# EasyEDA Pro project ProPrj_IRIS_2026-04-09.epro, schematic Schematic1
Board Name: Board1; Create Date: 2026-03-19; Page Name: P1; Project Name: Drone; Schematic Name: Schematic1; Update Date: 2026-04-08; Company: EasyEDA.com; Page Size: A4; Version: V1.0
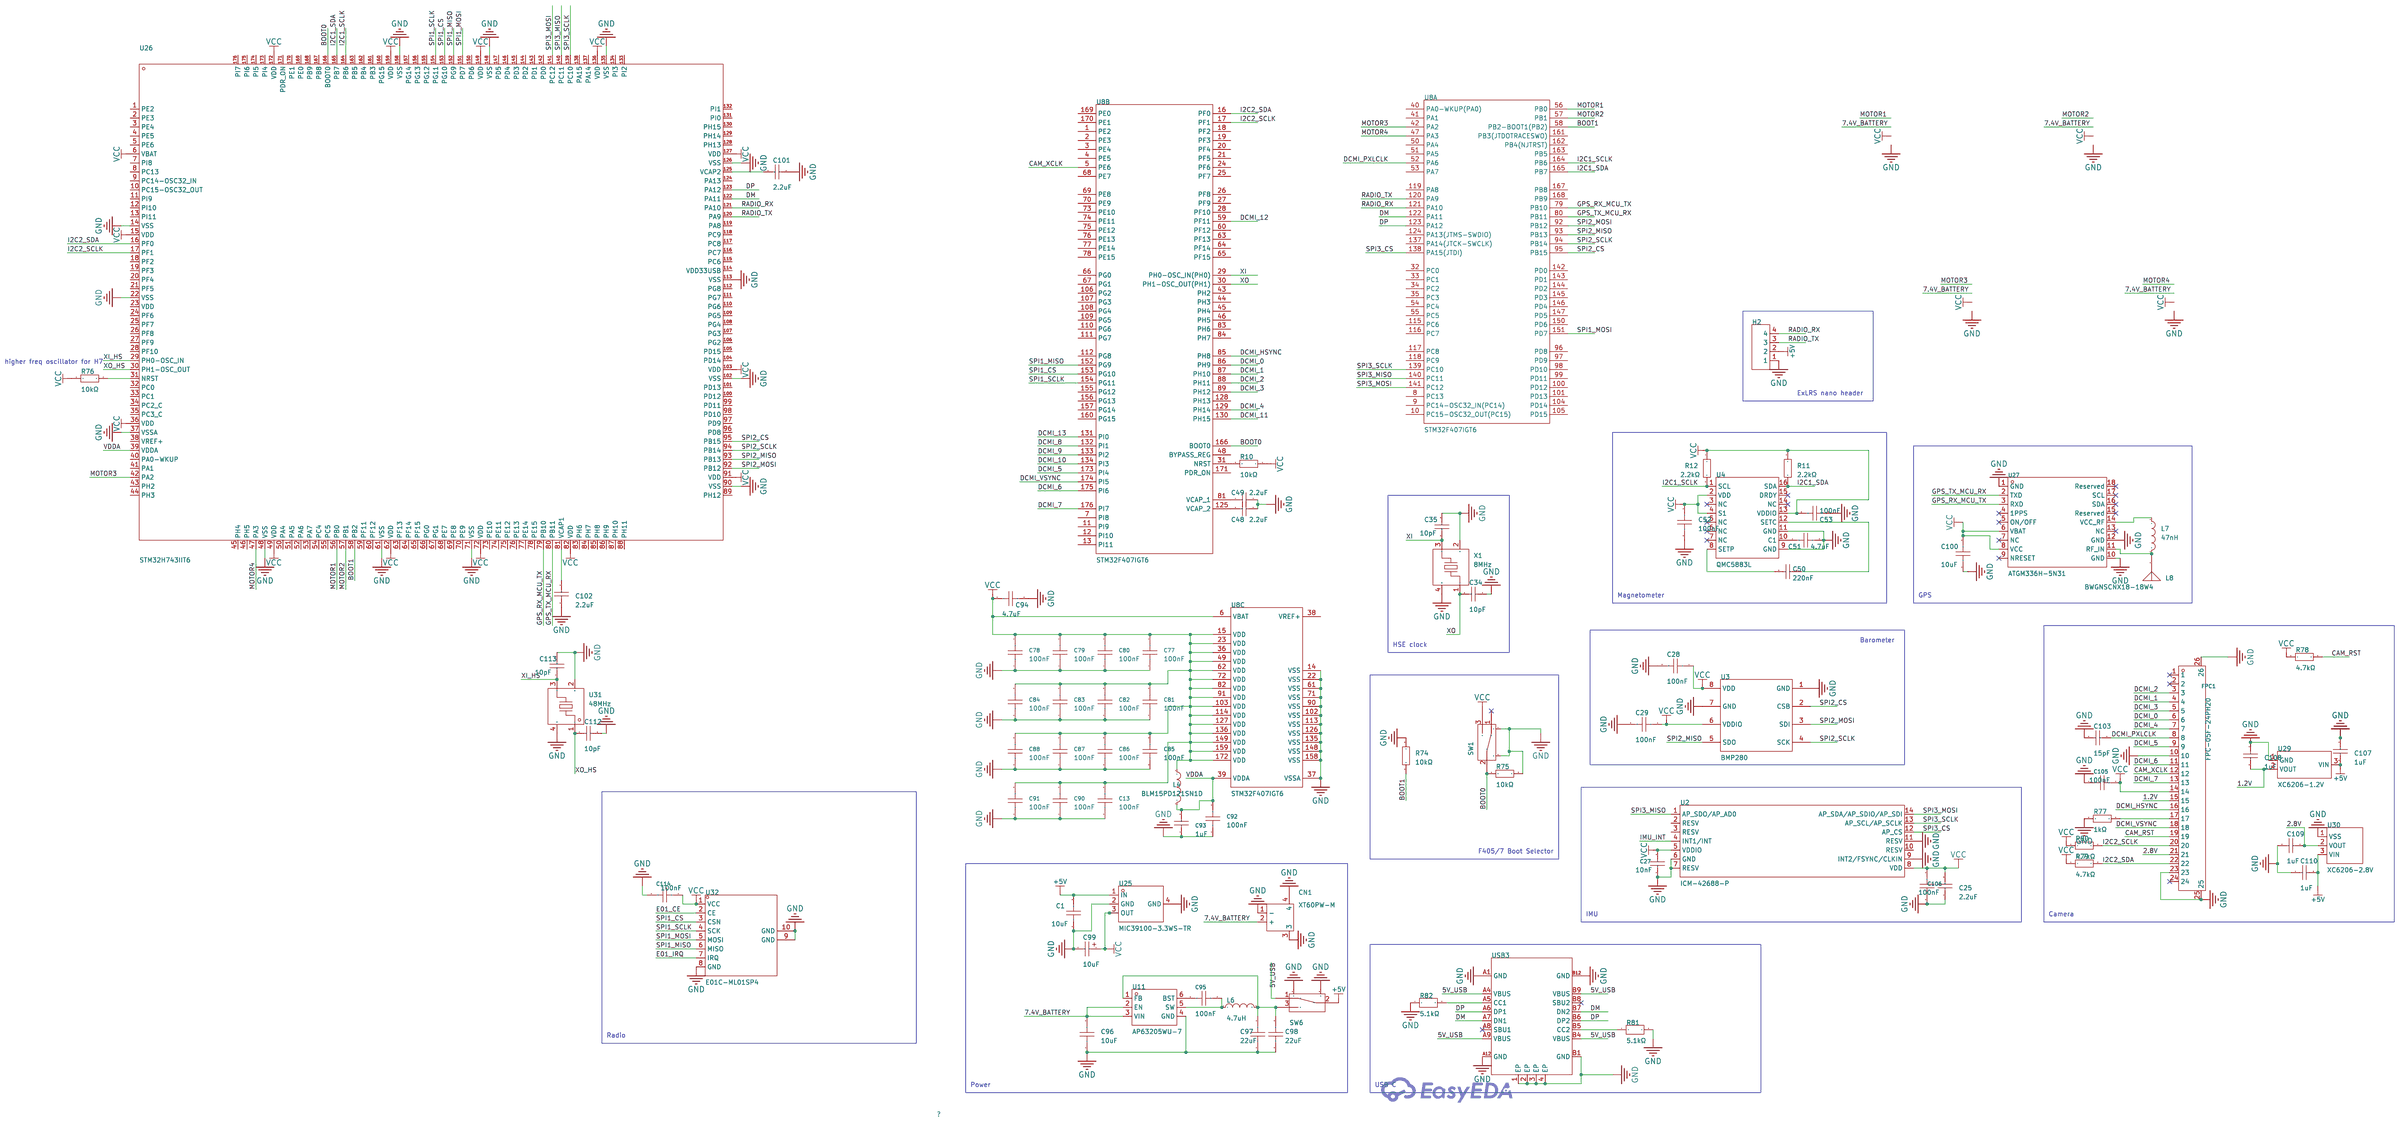
[diagram p1: schematic sheet]

## Parts
C1  10uF  [C0603]
C13  100nF  [C0402]
C25  2.2uF  [C0603]
C27  10nF  [C0603]
C28  100nF  [C0603]
C29  100nF  [C0603]
C34  10pF  [C0603]
C35  10pF  [C0603]
C48  2.2uF  [C0603]
C49  2.2uF  [C0603]
C50  220nF  [C0402]
C51  4.7uF  [C0603]
C52  100nF  [C0603]
C53  100nF  [C0603]
C77  100nF  [C0402]
C78  100nF  [C0402]
C79  100nF  [C0402]
C80  100nF  [C0402]
C81  100nF  [C0402]
C82  100nF  [C0402]
C83  100nF  [C0402]
C84  100nF  [C0402]
C85  100nF  [C0402]
C86  100nF  [C0402]
C87  100nF  [C0402]
C88  100nF  [C0402]
C90  100nF  [C0402]
C91  100nF  [C0402]
C92  100nF  [C0402]
C93  1uF  [C0402]
C94  4.7uF  [C0603]
C95  100nF  [C0402]
C96  10uF  [C0805]
C97  22uF  [C0603]
C98  22uF  [C0603]
C99  10uF  [CAP-SMD_L3.2-W1.6-RD-C7171]
C100  10uF  [C0603]
C101  2.2uF  [C0603]
C102  2.2uF  [C0603]
C103  15pF  [C0603]
C105  100nF  [C0402]
C106  100nF  [C0402]
C107  1uF  [C0402]
C108  1uF  [C0402]
C109  1uF  [C0402]
C110  1uF  [C0402]
C112  10pF  [C0603]
C113  10pF  [C0603]
C114  100nF  [C0402]
CBB1  -
CBB2  -
CBB3  -
CBB4  -
CN1  XT60PW-M  [CONN-TH_XT60PW-M]
FPC1  FPC-05F-24PH20  [FPC-SMD_24P-P0.50_FPC-05F-24PH20]
H2  HX PH254-01-04-Z-L11.5 straight pin header  [HDR-TH_4P-HX-PH254-01-04-Z-L11.5]
L4  BLM15PD121SN1D  [L0402]
L6  4.7uH  [IND-SMD_L3.0-W3.0-1]
L7  47nH  [IND-SMD_L1.8-W1.0]
L8  BWGNSCNX18-18W4  [ANT-TH_L18.0-W18.0_C9900026472]
R10  10kΩ  [R0603]
R11  2.2kΩ  [R0603]
R12  2.2kΩ  [R0603]
R74  10kΩ  [R0402]
R75  10kΩ  [R0402]
R76  10kΩ  [R0603]
R77  1kΩ  [R0402]
R78  4.7kΩ  [R0402]
R79  4.7kΩ  [R0402]
R80  4.7kΩ  [R0402]
R81  5.1kΩ  [R0603]
R82  5.1kΩ  [R0603]
SW1  -  [SW-TH_SK12D07VG3]
SW6  -  [SW-TH_SK12D07VG3]
U2  ICM-42688-P  [LGA-14_L3.0-W2.5-P0.50-TL]
U3  BMP280  [LGA-8_L2.5-W2.0-P0.65_AMP6127]
U4  QMC5883L  [LGA-16_L3.0-W3.0-P0.50-BL_SQ]
U8  STM32F407IGT6  [LQFP-176_L24.0-W24.0-P0.50-BL]  (sections 1,2,3)
U11  AP63205WU-7  [TSOT-23-6_L2.9-W1.6-P0.95-LS2.8-BL]
U25  MIC39100-3.3WS-TR  [SOT-223-4_L6.5-W3.5-P2.30-LS7.0-BR]
U26  STM32H743IIT6  [LQFP-176_L24.0-W24.0-P0.50-LS26.0-BL]
U27  ATGM336H-5N31  [GPSM-SMD_ATGM336H-TR]
U29  XC6206-1.2V  [SOT-23-3_L3.0-W1.6-P1.90-LS2.8-BR]
U30  XC6206-2.8V  [SOT-23-3_L2.9-W1.6-P1.90-LS2.8-BR]
U31  48MHz  [CRYSTAL-SMD_4P-L2.0-W1.6-BL]
U32  E01C-ML01SP4  [COMM-SMD_E01C-ML01SP4]
USB3  -  [USB-C-SMD_KH-TYPE-C-16P]
X1  8MHz  [CRYSTAL-SMD_4P-L3.2-W2.5-BL]

## Library data of the parts
C1 C100 = CL10A106KP8NNNC: Capacitance:10uF Tolerance:±10% Tolerance:±10% Voltage Rating:10V Temperature Coefficient:X5R; LCSC Part Name: 10uF ±10% 10V; Supplier Part: C19702; Manufacturer: SAMSUNG(三星); Supplier Footprint: 0603; Datasheet: https://item.szlcsc.com/datasheet/CL10A106KP8NNNC/20411.html; Supplier: LCSC; Tolerance: ±10%; Voltage Rating: 10V; Temperature Coefficient: X5R
C13 C77-C88 C90-C92 C95 C105 C106 C114 = CC0402KRX7R7BB104: Capacitance: Tolerance:±10% Tolerance:±10% Voltage Rated: Temperature Coefficient:; LCSC Part Name: 100nF ±10% 16V; Supplier Part: C60474; Manufacturer: YAGEO(国巨); Supplier Footprint: 0402; Datasheet: https://atta.szlcsc.com/upload/public/pdf/source/20211223/9278FD768280B81DDBEF48FA36411A03.pdf; Supplier: LCSC; Tolerance: ±10%
C25 C48 C49 C101 C102 = CL10A225KO8NNNC: Capacitance:2.2uF Tolerance:±10% Tolerance:±10% Voltage Rating:16V Temperature Coefficient:X5R; LCSC Part Name: 2.2uF ±10% 16V; Supplier Part: C23630; Manufacturer: SAMSUNG(三星); Supplier Footprint: 0603; JLCPCB Part Class: Basic Part; Datasheet: https://item.szlcsc.com/datasheet/CL10A225KO8NNNC/24366.html; Supplier: LCSC; Tolerance: ±10%; Voltage Rating: 16V; Temperature Coefficient: X5R
C27 = CC0603KRX7R9BB103: Capacitance:10nF Tolerance:±10% Tolerance:±10% Voltage Rating:50V Temperature Coefficient:X7R; LCSC Part Name: 10nF ±10% 50V; Supplier Part: C100042; Manufacturer: YAGEO(国巨); Supplier Footprint: 0603; Datasheet: https://item.szlcsc.com/datasheet/CC0603KRX7R9BB103/101256.html; Supplier: LCSC; Tolerance: ±10%; Voltage Rating: 50V; Temperature Coefficient: X7R
C28 C29 C52 C53 = CC0603KRX7R9BB104: Capacitance:100nF Tolerance:±10% Tolerance:±10% Voltage Rating:50V Temperature Coefficient:X7R; LCSC Part Name: 100nF ±10% 50V; Supplier Part: C14663; Manufacturer: YAGEO(国巨); Supplier Footprint: 0603; JLCPCB Part Class: Basic Part; Datasheet: https://item.szlcsc.com/datasheet/CC0603KRX7R9BB104/15331.html; Supplier: LCSC; Tolerance: ±10%; Voltage Rating: 50V; Temperature Coefficient: X7R
C34 C35 C112 C113 = CC0603JRNPO9BN100: Capacitance:10pF Tolerance:±5% Tolerance:±5% Voltage Rating:50V Temperature Coefficient:NP0; LCSC Part Name: 10pF ±5% 50V; Supplier Part: C106245; Manufacturer: YAGEO(国巨); Supplier Footprint: 0603; JLCPCB Part Class: Extended Part; Datasheet: https://item.szlcsc.com/datasheet/CC0603JRNPO9BN100/107460.html; Supplier: LCSC; Tolerance: ±5%; Voltage Rating: 50V; Temperature Coefficient: NP0
C50 = CL05B224KO5NNNC: Capacitance:220nF Tolerance:±10% Tolerance:±10% Voltage Rating:16V Temperature Coefficient:X7R; LCSC Part Name: 220nF ±10% 16V; Supplier Part: C16772; Manufacturer: SAMSUNG(三星); Supplier Footprint: 0402; Datasheet: https://item.szlcsc.com/datasheet/CL05B224KO5NNNC/17456.html; Supplier: LCSC; Tolerance: ±10%; Voltage Rating: 16V; Temperature Coefficient: X7R
C51 C94 = CL10A475KO8NNNC: Capacitance:4.7uF Tolerance:±10% Tolerance:±10% Voltage Rating:16V Temperature Coefficient:X5R; LCSC Part Name: 4.7uF ±10% 16V; Supplier Part: C19666; Manufacturer: SAMSUNG(三星); Supplier Footprint: 0603; Datasheet: https://item.szlcsc.com/datasheet/CL10A475KO8NNNC/20375.html; Supplier: LCSC; Tolerance: ±10%; Voltage Rating: 16V; Temperature Coefficient: X5R
C93 = CL05A105KO5NNNC: Capacitance:1uF Tolerance:±10% Tolerance:±10% Voltage Rating:16V Temperature Coefficient:X5R; LCSC Part Name: 1uF ±10% 16V; Supplier Part: C29266; Manufacturer: SAMSUNG(三星); Supplier Footprint: 0402; JLCPCB Part Class: Extended Part; Datasheet: https://item.szlcsc.com/datasheet/CL05A105KO5NNNC/30018.html; Supplier: LCSC; Tolerance: ±10%; Voltage Rating: 16V; Temperature Coefficient: X5R
C96 = CL21B106KOQNNNE: Capacitance:10uF Tolerance:±10% Tolerance:±10% Voltage Rating:16V Temperature Coefficient:X7R; LCSC Part Name: 10uF ±10% 16V; Supplier Part: C95841; Manufacturer: SAMSUNG(三星); Supplier Footprint: 0805; JLCPCB Part Class: Extended Part; Datasheet: https://item.szlcsc.com/datasheet/CL21B106KOQNNNE/97045.html; Supplier: LCSC; Tolerance: ±10%; Voltage Rating: 16V; Temperature Coefficient: X7R
C97 C98 = CL10A226MP8NUNE: Capacitance:22uF Tolerance:±20% Tolerance:±20% Voltage Rating:10V Temperature Coefficient:X5R; LCSC Part Name: 22uF ±20% 10V; Supplier Part: C86295; Manufacturer: SAMSUNG(三星); Supplier Footprint: 0603; Datasheet: https://item.szlcsc.com/datasheet/CL10A226MP8NUNE/87471.html; Supplier: LCSC; Tolerance: ±20%; Voltage Rating: 10V; Temperature Coefficient: X5R
C99 = TAJA106K016RNJ: Capacitance:10uF Tolerance:±10% Tolerance:±10% Voltage Rating:16V Equivalent Series Resistance(ESR):3Ω@100kHz Operating Temperature:-55℃~+125℃ Operating Temperature:-55℃~+125℃; LCSC Part Name: 10uF ±10% 16V; Supplier Part: C7171; Manufacturer: Kyocera AVX; Supplier Footprint: CASE-A-3216-18(mm); JLCPCB Part Class: Basic Part; Supplier: LCSC; Tolerance: ±10%; Voltage Rating: 16V; Equivalent Series Resistance(ESR): 3Ω@100kHz; Operating Temperature: -55℃~+125℃
C103 = CL10C150JB8NNNC: Capacitance:15pF Tolerance:±5% Tolerance:±5% Voltage Rating:50V Temperature Coefficient:C0G; LCSC Part Name: 15pF ±5% 50V; Supplier Part: C1644; Manufacturer: SAMSUNG(三星); Supplier Footprint: 0603; JLCPCB Part Class: Basic Part; Datasheet: https://item.szlcsc.com/datasheet/CL10C150JB8NNNC/1996.html; Supplier: LCSC; Tolerance: ±5%; Voltage Rating: 50V; Temperature Coefficient: C0G
C107-C110 = CL05A105KP5NNNC: Capacitance:1uF Tolerance:±10% Tolerance:±10% Voltage Rating:10V Temperature Coefficient:X5R; LCSC Part Name: 1uF ±10% 10V; Supplier Part: C14445; Manufacturer: SAMSUNG(三星); Supplier Footprint: 0402; Datasheet: https://item.szlcsc.com/datasheet/CL05A105KP5NNNC/15107.html; Supplier: LCSC; Tolerance: ±10%; Voltage Rating: 10V; Temperature Coefficient: X5R
CN1 = XT60PW-M: colour:Yellow Connector type:Horizontal plug interface form:Male; LCSC Part Name: AMASS(艾迈斯)航模插头xt60连接器150公母对接pw锂电池公头 接PCB板卧式 黄色 公头XT60PW-M.G.Y; Supplier Part: C98732; Manufacturer: AMASS(艾迈斯); Datasheet: https://item.szlcsc.com/datasheet/XT60PW-M/99942.html; Supplier: LCSC; colour: Yellow; Connector type: Horizontal plug; interface form: Male
FPC1 = FPC-05F-24PH20: Locking Feature:Hinged Lid Contact Type:Surface Mount Number of Contacts:24P Pitch:0.5mm Mounting Type:Bottom Contact FFC, FCB Thickness:0.3mm FFC, FCB Thickness:0.3mm Height Above Board:2mm Contact Material:Phosphor Bronze Contact Plating:Tin Operating T; LCSC Part Name: 翻盖式 卧贴 P数:24P 间距:0.5mm; Supplier Part: C2856805; Manufacturer: XUNPU(讯普); Supplier Footprint: SMD,P=0.5mm,卧贴; JLCPCB Part Class: Extended Part; Datasheet: https://item.szlcsc.com/datasheet/FPC-05F-24PH20/3056903.html; Supplier: LCSC; Locking Feature: Hinged Lid; Contact Type: Surface Mount; Number of Contacts: 24P; Pitch: 0.5mm; Mounting Type: Bottom Contact; FFC, FCB Thickness: 0.3mm; Height Above Board: 2mm; Contact Material: Phosphor Bronze; Contact Plating: Tin; Operating Temperature: -25℃~+85℃; Rated Voltage (Max): 50V; Current Rating (Max): 500mA
H2 = HX PH254-01-04-Z-L11.5 straight pin header: Pin Structure:1x4P Pitch:2.54mm Circluar Pins/Square Pins:Pin Header Mounting Type:Through Hole Number of Rows:1 Number of Pins:4P Current Rating:3A Voltage Rating (Max):1kV Length of Mating Pin:6mm Insulation Height:2.5mm Length of End Connection Pin:3mm; LCSC Part Name: 1x4P 间距:2.54mm 方针 直插; Supplier Part: C52016392; Manufacturer: hanxia(韩下); Supplier Footprint: 插件,P=2.54mm; JLCPCB Part Class: Extended Part; Datasheet: https://item.szlcsc.com/datasheet/HX%2520PH254-01-04-Z-L11.5%2520straight%2520pin%2520header/54760437.html; Supplier: LCSC; Pin Structure: 1x4P; Pitch: 2.54mm; Circluar Pins/Square Pins: Pin Header; Mounting Type: Through Hole; Number of Rows: 1; Number of Pins: 4P; Current Rating: 3A; Voltage Rating (Max): 1kV; Length of Mating Pin: 6mm; Insulation Height: 2.5mm; Length of End Connection Pin: 3mm; Contact Material: Brass; Contact Plating: Gold; Operating Temperature: -40℃~+105℃
L4 = BLM15PD121SN1D: Impedance @ Frequency:120Ω@100MHz Tolerance:±25% Tolerance:±25% DC Resistance(DCR):90mΩ Current Rating:1.3A Number of Circuits:1 Operating Temperature:-55℃~+125℃ Operating Temperature:-55℃~+125℃; LCSC Part Name: 单路 0402磁珠 阻抗120Ω@100MHz; Supplier Part: C76891; Manufacturer: muRata(村田); Supplier Footprint: 0402; JLCPCB Part Class: Extended Part; Datasheet: https://item.szlcsc.com/datasheet/BLM15PD121SN1D/78018.html; Supplier: LCSC; Impedance @ Frequency: 120Ω@100MHz; Tolerance: ±25%; DC Resistance(DCR): 90mΩ; Current Rating: 1.3A; Number of Circuits: 1; Operating Temperature: -55℃~+125℃
L6 = ANR3015T4R7M: Inductance:4.7uH Tolerance:±20% Tolerance:±20% Current Rating:1.3A Current - Saturation(Isat):1.4A Type:Magnetic Shielded Inductor; LCSC Part Name: 4.7uH ±20% 1.4A 3x3x1.5mm; Supplier Part: C7427089; Manufacturer: APV(爱普微); Supplier Footprint: SMD,3x3mm; Datasheet: https://item.szlcsc.com/datasheet/ANR3015T4R7M/8418961.html; Supplier: LCSC; Tolerance: ±20%; Current Rating: 1.3A; Current - Saturation(Isat): 1.4A; Type: Magnetic Shielded Inductor
L7 = AHW1608C-47NJTF: Inductance:47nH Tolerance:±5% Tolerance:±5% Current Rating:600mA DC Resistance(DCR):0.28Ω Q @ Frequency:38 Frequency - Self Resonant:2000MHz Type:Wire-wound Chip Inductor; LCSC Part Name: 47nH ±5%; Supplier Part: C6807998; Manufacturer: APV(爱普微); Supplier Footprint: 0603; JLCPCB Part Class: Extended Part; Datasheet: https://atta.szlcsc.com/upload/public/pdf/source/20230523/1C3BB767D502EE2DA5073F35EE6596F6.pdf; Supplier: LCSC; Tolerance: ±5%; Current Rating: 600mA; DC Resistance(DCR): 0.28Ω; Q @ Frequency: 38; Frequency - Self Resonant: 2000MHz; Type: Wire-wound Chip Inductor
L8 = BWGNSCNX18-18W4: Antenna Type:Ceramic Antenna Frequency(Center/Band):1.57542GHz Bandwidth:10MHz Peak Gain:3dBi Peak Gain:3dBi Impedance:50Ω Power:50W VSWR:1.8 Operating Temperature:-40℃~+80℃ Operating Temperature:-40℃~+80℃ Length:18mm Width:18mm Height:4mm; LCSC Part Name: GNSS无源陶瓷片天线厚款; Supplier Part: C784395; Manufacturer: BAT WIRELESS(蝙蝠无线); Supplier Footprint: 插件,18x18mm; Datasheet: https://item.szlcsc.com/datasheet/BWGNSCNX18-18W4/839637.html; Supplier: LCSC; Antenna Type: Ceramic Antenna; Frequency(Center/Band): 1.57542GHz; Bandwidth: 10MHz; Peak Gain: 3dBi; Impedance: 50Ω; Power: 50W; VSWR: 1.8; Operating Temperature: -40℃~+80℃; Length: 18mm; Width: 18mm; Height: 4mm
R10 R76 = RC0603FR-0710KL: Type:Thick Film Resistors Resistance: Tolerance:±1% Tolerance:±1% Power(Watts): Overload Voltage (Max): Temperature Coefficient:±100ppm/℃ Temperature Coefficient:±100ppm/℃ Operating Temperature Range:-55℃~+155℃ Operating Temperature Range:-55℃~+155℃; LCSC Part Name: 厚膜电阻 10kΩ ±1% 100mW; Supplier Part: C98220; Manufacturer: YAGEO(国巨); Supplier Footprint: 0603; JLCPCB Part Class: Extended Part; Datasheet: https://atta.szlcsc.com/upload/public/pdf/source/20180927/C295883_E8D83085EA81BD7DE0B2B681138C15EE.pdf; Supplier: LCSC; Type: Thick Film Resistors; Tolerance: ±1%; Temperature Coefficient: ±100ppm/℃; Operating Temperature Range: -55℃~+155℃
R11 R12 = RC0603FR-072K2L: Type:Thick Film Resistor Resistance:2.2kΩ Tolerance:±1% Tolerance:±1% Power(Watts):100mW Voltage-Supply(Max):75V Temperature Coefficient:±100ppm/℃ Temperature Coefficient:±100ppm/℃ Operating Temperature:-55℃~+155℃ Operating Temperature:-55℃~+155℃; LCSC Part Name: 厚膜电阻 2.2kΩ ±1% 100mW; Supplier Part: C114662; Manufacturer: YAGEO(国巨); Supplier Footprint: 0603; Datasheet: https://item.szlcsc.com/datasheet/RC0603FR-072K2L/115906.html; Supplier: LCSC; Type: Thick Film Resistor; Tolerance: ±1%; Power(Watts): 100mW; Voltage-Supply(Max): 75V; Temperature Coefficient: ±100ppm/℃; Operating Temperature: -55℃~+155℃
R74 R75 = RC0402FR-0710KL: Type:Thick Film Resistor Resistance:10kΩ Tolerance:±1% Tolerance:±1% Power(Watts):62.5mW Voltage-Supply(Max):50V Temperature Coefficient:±100ppm/℃ Temperature Coefficient:±100ppm/℃ Operating Temperature:-55℃~+155℃ Operating Temperature:-55℃~+155℃; LCSC Part Name: 厚膜电阻 10kΩ ±1% 62.5mW; Supplier Part: C60490; Manufacturer: YAGEO(国巨); Supplier Footprint: 0402; JLCPCB Part Class: Extended Part; Datasheet: https://item.szlcsc.com/datasheet/RC0402FR-0710KL/61542.html; Supplier: LCSC; Type: Thick Film Resistor; Tolerance: ±1%; Power(Watts): 62.5mW; Voltage-Supply(Max): 50V; Temperature Coefficient: ±100ppm/℃; Operating Temperature: -55℃~+155℃
R77 = RC0402FR-071KL: Type:Thick Film Resistor Resistance:1kΩ Tolerance:±1% Tolerance:±1% Power(Watts):62.5mW Voltage-Supply(Max):50V Temperature Coefficient:±100ppm/℃ Temperature Coefficient:±100ppm/℃ Operating Temperature:-55℃~+155℃ Operating Temperature:-55℃~+155℃; LCSC Part Name: 厚膜电阻 1kΩ ±1% 62.5mW; Supplier Part: C106235; Manufacturer: YAGEO(国巨); Supplier Footprint: 0402; JLCPCB Part Class: Extended Part; Datasheet: https://item.szlcsc.com/datasheet/RC0402FR-071KL/107450.html; Supplier: LCSC; Type: Thick Film Resistor; Tolerance: ±1%; Power(Watts): 62.5mW; Voltage-Supply(Max): 50V; Temperature Coefficient: ±100ppm/℃; Operating Temperature: -55℃~+155℃
R78-R80 = RC0402FR-074K7L: Type:Thick Film Resistor Resistance:4.7kΩ Tolerance:±1% Tolerance:±1% Power(Watts):62.5mW Voltage-Supply(Max):50V Temperature Coefficient:±100ppm/℃ Temperature Coefficient:±100ppm/℃ Operating Temperature:-55℃~+155℃ Operating Temperature:-55℃~+155℃; LCSC Part Name: 厚膜电阻 4.7kΩ ±1% 62.5mW; Supplier Part: C105871; Manufacturer: YAGEO(国巨); Supplier Footprint: 0402; JLCPCB Part Class: Extended Part; Datasheet: https://item.szlcsc.com/datasheet/RC0402FR-074K7L/107086.html; Supplier: LCSC; Type: Thick Film Resistor; Tolerance: ±1%; Power(Watts): 62.5mW; Voltage-Supply(Max): 50V; Temperature Coefficient: ±100ppm/℃; Operating Temperature: -55℃~+155℃
R81 R82 = FRC0603F5101TS: Type:Thick Film Resistor Resistance:5.1kΩ Tolerance:±1% Tolerance:±1% Power(Watts):100mW Voltage-Supply(Max):75V Temperature Coefficient:±100ppm/℃ Temperature Coefficient:±100ppm/℃ Operating Temperature:-55℃~+155℃ Operating Temperature:-55℃~+155℃; LCSC Part Name: 5.1kΩ ±1% 100mW 厚膜电阻; Supplier Part: C2907044; Manufacturer: FOJAN(富捷); Supplier Footprint: 0603; JLCPCB Part Class: Extended Part; Supplier: LCSC; Type: Thick Film Resistor; Tolerance: ±1%; Power(Watts): 100mW; Voltage-Supply(Max): 75V; Temperature Coefficient: ±100ppm/℃; Operating Temperature: -55℃~+155℃
SW1 SW6 = SK12D07VG3: Supplier Footprint: Through
U2 = ICM-42688-P: Sensor Type:Accelerometer gyroscope; Supplier Part: C1850418; Manufacturer: TDK InvenSense(应美盛); Supplier Footprint: LGA-14(2.5x3); JLCPCB Part Class: Extended Part; Datasheet: https://atta.szlcsc.com/upload/public/pdf/source/20210703/CF24204867ACE5B754A2B035F23E5931.pdf; Supplier: LCSC; Sensor Type: Accelerometer gyroscope
U3 = BMP280: Pressure range:30Kpa~1.1bar Pressure range:30Kpa~1.1bar Voltage - Supply:1.71V~3.6V Voltage - Supply:1.71V~3.6V Standby Current:300nA Interface:SPI；I2C Operating Temperature:-40℃~+85℃ Operating Temperature:-40℃~+85℃ Absolute Accuracy:1hpa Relative Accurac; Supplier Part: C83291; Manufacturer: Bosch(博世); Supplier Footprint: LGA-8(2x2.5); Datasheet: https://item.szlcsc.com/datasheet/BMP280/84455.html; Supplier: LCSC; Pressure range: 30Kpa~1.1bar; Voltage - Supply: 1.71V~3.6V; Standby Current: 300nA; Interface: SPI；I2C; Operating Temperature: -40℃~+85℃; Absolute Accuracy: 1hpa; Relative Accuracy: 0.12hpa; Temperature Coefficient of Offset(TCO): 1.5pa/K
U4 = QMC5883L: Magnetic Sensing Range(X,Y):±8Gs Magnetic Sensing Range(X,Y):±8Gs Magnetic Sensing Range(Z):±8Gs Magnetic Sensing Range(Z):±8Gs Output bit:16bit Interface Type:I2C Voltage - Supply:2.16V~3.6V Voltage - Supply:2.16V~3.6V Current - Supply:75uA Operating Tem; LCSC Part Name: 三轴磁传感器 停产; Supplier Part: C976032; Manufacturer: QST(上海矽睿); Supplier Footprint: LGA-16(3x3); Datasheet: https://item.szlcsc.com/datasheet/QMC5883L/1066453.html; Supplier: LCSC; Magnetic Sensing Range(X,Y): ±8Gs; Magnetic Sensing Range(Z): ±8Gs; Output bit: 16bit; Interface Type: I2C; Voltage - Supply: 2.16V~3.6V; Current - Supply: 75uA; Operating Temperature: -40℃~+85℃
U8 = STM32F407IGT6: CPU Core:ARM Cortex-M4 CPU Maximum Speed:168MHz Core Size:32 Bit Program Storage Size:1MB Program Memory Type:FLASH RAM Size:192KB EEPROM:- Number of I/O:140 ADC (Bit):12bit DAC (Bit):12bit Oscillator Type:Built-in Voltage - Supply:1.8V~3.6V Voltage - Sup; LCSC Part Name: 带DSP和FPU的高性能基础系列ARM Cortex-M4 MCU，具有1 MB Flash、168 MHz CPU、ART加速器、以太网和FSMC; Supplier Part: C33993; Manufacturer: ST(意法半导体); Supplier Footprint: LQFP-176(24x24); JLCPCB Part Class: Extended Part; Datasheet: https://item.szlcsc.com/datasheet/STM32F407IGT6/34961.html; Supplier: LCSC; CPU Core: ARM Cortex-M4; CPU Maximum Speed: 168MHz; Core Size: 32 Bit; Program Storage Size: 1MB; Program Memory Type: FLASH; RAM Size: 192KB; Number of I/O: 140; ADC (Bit): 12bit; DAC (Bit): 12bit; Oscillator Type: Built-in; Voltage - Supply: 1.8V~3.6V; Operating Temperature: -40℃~+85℃
U11 = AP63205WU-7: Function:Buck Voltage - Supply:3.8V~32V Voltage - Supply:3.8V~32V Output Voltage:5V Output Voltage:5V Output Current:2A Frequency - Switching:1.1MHz Frequency - Switching:1.1MHz Operating Temperature:-40℃~+85℃@(TA) Operating Temperature:-40℃~+85℃@(TA) Syn; LCSC Part Name: 3.8V至32V输入、2A低静态电流同步降压转换器，增强EMI抑制; Supplier Part: C2071056; Manufacturer: DIODES(美台); Supplier Footprint: TSOT-23-6; Datasheet: https://item.szlcsc.com/datasheet/AP63205WU-7/2162639.html; Supplier: LCSC; Function: Buck; Voltage - Supply: 3.8V~32V; Output Voltage: 5V; Output Current: 2A; Frequency - Switching: 1.1MHz; Operating Temperature: -40℃~+85℃@(TA); Synchronous Rectifier: Yes; Number of Outputs: 1; Topology: Buck; Quiescent Current: 22uA; Switch tube (built-in/external): Built-In; Output Type: Fixed
U25 = MIC39100-3.3WS-TR: Output Type:Fixed Voltage - Supply:16V Output Voltage:3.3V Output Voltage:3.3V Output Current:1A Power Supply Rejection Ratio (PSRR):- Voltage Dropout:630mV@(1A) standby current:20mA Features:Over Current Protection；Reverse Polarity Protection；Over Temper; LCSC Part Name: 输入16V 输出3.3V 1A; Supplier Part: C481371; Manufacturer: MICROCHIP(美国微芯); Supplier Footprint: SOT-223; JLCPCB Part Class: Extended Part; Datasheet: https://item.szlcsc.com/datasheet/MIC39100-3.3WS-TR/488912.html; Supplier: LCSC; Output Type: Fixed; Voltage - Supply: 16V; Output Voltage: 3.3V; Output Current: 1A; Voltage Dropout: 630mV@(1A); standby current: 20mA; Features: Over Current Protection；Reverse Polarity Protection；Over Temperature Protection; Operating Temperature: -40℃~+125℃@(Tj); Output Configuration: Positive; Number of Outputs: 1
U26 = STM32H743IIT6: CPU Core:- CPU Maximum Speed:480MHz Program Storage Size:2MB Program Memory Type:FLASH Number of I/O:140 ADC (Bit):16bit DAC (Bit):12bit Voltage - Supply:1.62V~3.6V Voltage - Supply:1.62V~3.6V; LCSC Part Name: 带DSP和DP-FPU的高性能ARM Cortex-M7 MCU，具有2 MB Flash、1 MB RAM、480 MHz CPU、ART加速器、一级缓存、外部存储器接口和大量外设; Supplier Part: C89597; Manufacturer: ST(意法半导体); Supplier Footprint: LQFP-176(24x24); Datasheet: https://item.szlcsc.com/datasheet/STM32H743IIT6/90777.html; Supplier: LCSC; CPU Maximum Speed: 480MHz; Program Storage Size: 2MB; Program Memory Type: FLASH; Number of I/O: 140; ADC (Bit): 16bit; DAC (Bit): 12bit; Voltage - Supply: 1.62V~3.6V
U27 = ATGM336H-5N31: GNSS Type:BDS；GPS Interface:UART；I2C Voltage - Supply:2.7V~3.6V Voltage - Supply:2.7V~3.6V Current - Supply:25mA@3.3V Sensitivity:-148dBm Sensitivity:-148dBm Accuracy:2.5m Time To First Fix:35s Operating Temperature:-40℃~+85℃ Operating Temperature:-40℃~+8; LCSC Part Name: BDS/GNSS 全星座定位导航模块; Supplier Part: C90770; Manufacturer: 杭州中科微; Supplier Footprint: SMD,10.1x9.7mm; Datasheet: https://item.szlcsc.com/datasheet/ATGM336H-5N31/91958.html; Supplier: LCSC; GNSS Type: BDS；GPS; Interface: UART；I2C; Voltage - Supply: 2.7V~3.6V; Current - Supply: 25mA@3.3V; Sensitivity: -148dBm; Accuracy: 2.5m; Time To First Fix: 35s; Operating Temperature: -40℃~+85℃
U29 = XC6206-1.2V_C49446790: Output Type:Fixed Voltage - Supply:6.5V Output Voltage:1.2V Output Voltage:1.2V Output Current:400mA Features:Short Circuit Protection；Over Current Protection Operating Temperature:-40℃~+125℃ Operating Temperature:-40℃~+125℃ Output Configuration:Positive; LCSC Part Name: 1.2V 400mA 6.5V; Supplier Part: C49446790; Manufacturer: YONGYUTAI(永裕泰); Supplier Footprint: SOT-23-3; Datasheet: https://item.szlcsc.com/datasheet/XC6206-1.2V/51987195.html; Supplier: LCSC; Output Type: Fixed; Voltage - Supply: 6.5V; Output Voltage: 1.2V; Output Current: 400mA; Features: Short Circuit Protection；Over Current Protection; Operating Temperature: -40℃~+125℃; Output Configuration: Positive; Number of Outputs: 1
U30 = XC6206-2.8V: Output Type:Fixed Voltage - Supply:6V Output Voltage:2.8V Output Voltage:2.8V Output Current:250mA Power Supply Rejection Ratio (PSRR):- Voltage Dropout:350mV@(30mA) standby current:1uA Noise:- Features:Over Current Protection Operating Temperature:-40℃~+; LCSC Part Name: 输入6V 输出2.8V 250mA; Supplier Part: C2892669; Manufacturer: YONGYUTAI(永裕泰); Supplier Footprint: SOT-23-3L; JLCPCB Part Class: Extended Part; Datasheet: https://item.szlcsc.com/datasheet/XC6206-2.8V/3124288.html; Supplier: LCSC; Output Type: Fixed; Voltage - Supply: 6V; Output Voltage: 2.8V; Output Current: 250mA; Voltage Dropout: 350mV@(30mA); standby current: 1uA; Features: Over Current Protection; Operating Temperature: -40℃~+85℃@(Ta); Output Configuration: Positive; Number of Outputs: 1
U31 = ABM11W-48.0000MHZ-7-B1U-T3: Frequency:48MHz Normal temperature Frequency Tolerance:±10ppm Normal temperature Frequency Tolerance:±10ppm Load Capacitor: Frequency Stability(Full temperature range):±10ppm Frequency Stability(Full temperature range):±10ppm Equivalent Series Resistance; LCSC Part Name: 48MHz ±10ppm 7pF; Supplier Part: C1985532; Manufacturer: ABRACON; Supplier Footprint: SMD2016-4P; Datasheet: https://atta.szlcsc.com/upload/public/pdf/source/20210612/25E10314463341ECFDA871AE575B9E16.pdf; Supplier: LCSC; Normal temperature Frequency Tolerance: ±10ppm; Frequency Stability(Full temperature range): ±10ppm; Equivalent Series Resistance (ESR): 40Ω
U32 = E01C-ML01SP4: LCSC Part Name: 2.4GHz无线数传收发模块国产Si24R1+PA+LNA透传兼容nRF24L01芯片; Supplier Part: C2965508; Manufacturer: EBYTE(亿佰特); Supplier Footprint: SMD,14.5x18mm; JLCPCB Part Class: Extended Part; Datasheet: https://item.szlcsc.com/datasheet/E01C-ML01SP4/3357269.html; Supplier: LCSC
USB3 = USB_TYPE-C-16P: Supplier Footprint: Through
X1 = Y32258MEBCX: Type:Crystal Oscillator Frequency:8MHz Normal temperature Frequency Tolerance:±10ppm Normal temperature Frequency Tolerance:±10ppm Load Capacitance:10pF Frequency Stability:±20ppm Frequency Stability:±20ppm Operating Temperature:-40℃~+85℃ Operating Temper; LCSC Part Name: 8MHz ±10ppm 10pF; Supplier Part: C49158085; Manufacturer: JLYE(晶力源); Supplier Footprint: SMD3225-4P; JLCPCB Part Class: Extended Part; Datasheet: https://item.szlcsc.com/datasheet/Y32258MEBCX/51546118.html; Supplier: LCSC; Type: Crystal Oscillator; Normal temperature Frequency Tolerance: ±10ppm; Load Capacitance: 10pF; Frequency Stability: ±20ppm; Operating Temperature: -40℃~+85℃

## Nets
1.2V: C108.2 FPC1.15 U29.2(VOUT)
2.8V: C109.2 FPC1.21 U30.2(VOUT)
5V_USB: SW6.1 USB3.A4(VBUS) USB3.A9(VBUS) USB3.B4(VBUS) USB3.B9(VBUS)
7.4V_BATTERY: C96.2 CBB1.2(VIN) CBB2.2(VIN) CBB3.2(VIN) CBB4.2(VIN) CN1.2(+) U11.2(EN) U11.3(VIN)
+5V: C1.2 C107.2 C110.2 H2.2 SW6.2 U25.1(IN) U29.3(VIN) U30.3(VIN)
GND: C1.1 C13.1 C25.1 C27.1 C28.2 C29.2 C34.2 C35.2 C48.2 C49.2 C51.2 C52.2 C53.2 C77.1 C78.1 C79.1 C80.1 C81.1 C82.1 C83.1 C84.1 C85.1 C86.1 C87.1 C88.1 C90.1 C91.1 C92.1 C93.1 C94.2 C96.1 C97.1 C98.1 C99.2 C100.1 C101.1 C102.1 C103.1 C105.1 C106.2 C107.1 C108.1 C109.1 C110.1 C112.2 C113.2 C114.2 CBB1.4(GND) CBB2.4(GND) CBB3.4(GND) CBB4.4(GND) CN1.1(-) CN1.3 CN1.4 FPC1.10 FPC1.23 FPC1.25 FPC1.26 H2.1 R74.2 R75.2 R77.1 R81.2 R82.1 SW1.4 SW1.5 SW6.4 SW6.5 U2.6(GND) U2.7(RESV) U2.9(INT2/FSYNC/CLKIN) U2.11(RESV) U3.1(GND) U3.7(GND) U4.9(GND) U4.11(GND) U8.14(VSS) U8.22(VSS) U8.37(VSSA) U8.61(VSS) U8.71(VSS) U8.90(VSS) U8.102(VSS) U8.113(VSS) U8.126(VSS) U8.135(VSS) U8.148(VSS) U8.158(VSS) U11.4(GND) U25.2(GND) U25.4(GND) U26.14(VSS) U26.22(VSS) U26.37(VSSA) U26.48(VSS) U26.61(VSS) U26.71(VSS) U26.90(VSS) U26.102(VSS) U26.113(VSS) U26.126(VSS) U26.135(VSS) U26.148(VSS) U26.158(VSS) U27.1(GND) U27.10(GND) U27.12(GND) U29.1(GND) U30.1(VSS) U31.2(GND) U31.4(GND) U32.8(GND) U32.9(GND) U32.10(GND) USB3.1(EP) USB3.2(EP) USB3.3(EP) USB3.4(EP) USB3.A1(GND) USB3.A12(GND) USB3.B1(GND) USB3.B12(GND) X1.2(GND) X1.4(GND)
VCC: C13.2 C25.2 C27.2 C28.1 C29.1 C52.1 C53.1 C77.2 C78.2 C79.2 C80.2 C81.2 C82.2 C83.2 C84.2 C85.2 C86.2 C87.2 C88.2 C90.2 C91.2 C94.1 C99.1 C100.2 C105.2 C106.1 C114.1 CBB1.3(3V3) CBB2.3(3V3) CBB3.3(3V3) CBB4.3(3V3) FPC1.14 L4.1 R10.1 R11.1 R12.1 R76.1 R78.1 R79.1 R80.1 SW1.3 U2.5(VDDIO) U2.8(VDD) U3.6(VDDIO) U3.8(VDD) U4.2(VDD) U4.4(S1) U4.13(VDDIO) U8.6(VBAT) U8.15(VDD) U8.23(VDD) U8.36(VDD) U8.49(VDD) U8.62(VDD) U8.72(VDD) U8.82(VDD) U8.91(VDD) U8.103(VDD) U8.114(VDD) U8.127(VDD) U8.136(VDD) U8.149(VDD) U8.159(VDD) U8.172(VDD) U25.3(OUT) U26.6(VBAT) U26.15(VDD) U26.36(VDD) U26.49(VDD) U26.62(VDD) U26.72(VDD) U26.82(VDD) U26.91(VDD) U26.103(VDD) U26.127(VDD) U26.136(VDD) U26.149(VDD) U26.159(VDD) U26.172(VDD) U27.6(VBAT) U27.8(VCC) U32.1(VCC)
VDDA: C92.2 C93.2 L4.2 U8.39(VDDA) U26.39(VDDA)
BOOT0: R75.1 SW1.2 U8.166(BOOT0) U26.166(BOOT0)
BOOT1: R74.1 U8.58(PB2-BOOT1(PB2)) U26.58(PB2)
CAM_RST: FPC1.19 R78.2
CAM_XCLK: FPC1.12 U8.5(PE6)
DCMI_0: FPC1.6 U8.86(PH9)
DCMI_1: FPC1.4 U8.87(PH10)
DCMI_2: FPC1.3 U8.88(PH11)
DCMI_3: FPC1.5 U8.89(PH12)
DCMI_4: FPC1.7 U8.129(PH14)
DCMI_5: FPC1.9 U8.173(PI4)
DCMI_6: FPC1.11 U8.175(PI6)
DCMI_7: FPC1.13 U8.176(PI7)
DCMI_8: U8.132(PI1)
DCMI_9: U8.133(PI2)
DCMI_10: U8.134(PI3)
DCMI_11: U8.130(PH15)
DCMI_12: U8.59(PF11)
DCMI_13: U8.131(PI0)
DCMI_HSYNC: FPC1.16 U8.85(PH8)
DCMI_PXLCLK: C103.2 FPC1.8 U8.52(PA6)
DCMI_VSYNC: FPC1.18 U8.174(PI5)
DM: U8.122(PA11) U26.122(PA11) USB3.A7(DN1) USB3.B7(DN2)
DP: U8.123(PA12) U26.123(PA12) USB3.A6(DP1) USB3.B6(DP2)
E01_CE: U32.2(CE)
E01_IRQ: U32.7(IRQ)
GPS_RX_MCU_TX: U8.79(PB10) U26.79(PB10) U27.3(RXD)
GPS_TX_MCU_RX: U8.80(PB11) U26.80(PB11) U27.2(TXD)
I2C1_SCLK: R12.2 U4.1(SCL) U8.164(PB6) U26.164(PB6)
I2C1_SDA: R11.2 U4.16(SDA) U8.165(PB7) U26.165(PB7)
I2C2_SCLK: FPC1.20 R80.2 U8.17(PF1) U26.17(PF1)
I2C2_SDA: FPC1.22 R79.2 U8.16(PF0) U26.16(PF0)
IMU_INT: U2.4(INT1/INT)
MOTOR1: CBB1.1(MOTOR_IN) U8.56(PB0) U26.56(PB0)
MOTOR2: CBB2.1(MOTOR_IN) U8.57(PB1) U26.57(PB1)
MOTOR3: CBB4.1(MOTOR_IN) U8.42(PA2) U26.42(PA2)
MOTOR4: CBB3.1(MOTOR_IN) U8.47(PA3) U26.47(PA3)
RADIO_RX: H2.4 U8.121(PA10) U26.121(PA10)
RADIO_TX: H2.3 U8.120(PA9) U26.120(PA9)
SPI1_CS: U8.153(PG10) U26.153(PG10) U32.3(CSN)
SPI1_MISO: U8.152(PG9) U26.152(PG9) U32.6(MISO)
SPI1_MOSI: U8.151(PD7) U26.151(PD7) U32.5(MOSI)
SPI1_SCLK: U8.154(PG11) U26.154(PG11) U32.4(SCK)
SPI2_CS: U3.2(CSB) U8.95(PB15) U26.95(PB15)
SPI2_MISO: U3.5(SDO) U8.93(PB13) U26.93(PB13)
SPI2_MOSI: U3.3(SDI) U8.92(PB12) U26.92(PB12)
SPI2_SCLK: U3.4(SCK) U8.94(PB14) U26.94(PB14)
SPI3_CS: U2.12(AP_CS) U8.138(PA15(JTDI))
SPI3_MISO: U2.1(AP_SDO/AP_AD0) U8.140(PC11) U26.140(PC11)
SPI3_MOSI: U2.14(AP_SDA/AP_SDIO/AP_SDI) U8.141(PC12) U26.141(PC12)
SPI3_SCLK: U2.13(AP_SCL/AP_SCLK) U8.139(PC10) U26.139(PC10)
XI: C35.1 U8.29(PH0-OSC_IN(PH0)) X1.3
XI_HS: C113.1 U26.29(PH0-OSC_IN) U31.3
XO: C34.1 U8.30(PH1-OSC_OUT(PH1)) X1.1
XO_HS: C112.1 U26.30(PH1-OSC_OUT) U31.1
$1N17368: C97.2 C98.2 L6.2 SW6.3 U11.1(FB)
$1N17546: C95.1 L6.1 U11.5(SW)
$1N17973: R10.2 U8.31(NRST)
$1N17975: C49.1 U8.81(VCAP_1)
$1N17977: C48.1 U8.125(VCAP_2)
$1N18305: C50.2 U4.12(SETC)
$1N18391: C51.1 U4.10(C1)
$1N18545: C50.1 U4.8(SETP)
$1N56559: C95.2 U11.6(BST)
$1N79325: L7.2 L8.1 U27.11(RF_IN)
$1N79329: L7.1 U27.14(VCC_RF)
$1N80218: R76.2 U26.31(NRST)
$1N80254: C101.2 U26.125(VCAP2)
$1N80328: C102.2 U26.81(VCAP1)
$1N81168: FPC1.17 R77.2
$1N85586: R81.1 USB3.B5(CC2)
$1N85625: R82.2 USB3.A5(CC1)

Not connected (* = marked no-connect by the designer): FPC1 1* 2* 24*; SW1 1*; U2 2(RESV) 3(RESV) 10(RESV); U4 3(NC)* 5(NC)* 6(NC)* 7(NC)* 14(NC)* 15(DRDY)*; U8 1(PE2) 2(PE3) 3(PE4) 4(PE5) 7(PI8) 8(PC13) 9(PC14-OSC32_IN(PC14)) 10(PC15-OSC32_OUT(PC15)) 11(PI9) 12(PI10) 13(PI11) 18(PF2) 19(PF3) 20(PF4) 21(PF5) 24(PF6) 25(PF7) 26(PF8) 27(PF9) 28(PF10) 32(PC0) 33(PC1) 34(PC2) 35(PC3) 38(VREF+) 40(PA0-WKUP(PA0)) 41(PA1) 43(PH2) 44(PH3) 45(PH4) 46(PH5) 48(BYPASS_REG) 50(PA4) 51(PA5) 53(PA7) 54(PC4) 55(PC5) 60(PF12) 63(PF13) 64(PF14) 65(PF15) 66(PG0) 67(PG1) 68(PE7) 69(PE8) 70(PE9) 73(PE10) 74(PE11) 75(PE12) 76(PE13) 77(PE14) 78(PE15) 83(PH6) 84(PH7) 96(PD8) 97(PD9) 98(PD10) 99(PD11) 100(PD12) 101(PD13) 104(PD14) 105(PD15) 106(PG2) 107(PG3) 108(PG4) 109(PG5) 110(PG6) 111(PG7) 112(PG8) 115(PC6) 116(PC7) 117(PC8) 118(PC9) 119(PA8) 124(PA13(JTMS-SWDIO)) 128(PH13) 137(PA14(JTCK-SWCLK)) 142(PD0) 143(PD1) 144(PD2) 145(PD3) 146(PD4) 147(PD5) 150(PD6) 155(PG12) 156(PG13) 157(PG14) 160(PG15) 161(PB3(JTDOTRACESWO)) 162(PB4(NJTRST)) 163(PB5) 167(PB8) 168(PB9) 169(PE0) 170(PE1) 171(PDR_ON); U26 1(PE2) 2(PE3) 3(PE4) 4(PE5) 5(PE6) 7(PI8) 8(PC13) 9(PC14-OSC32_IN) 10(PC15-OSC32_OUT) 11(PI9) 12(PI10) 13(PI11) 18(PF2) 19(PF3) 20(PF4) 21(PF5) 23(VDD) 24(PF6) 25(PF7) 26(PF8) 27(PF9) 28(PF10) 32(PC0) 33(PC1) 34(PC2_C) 35(PC3_C) 38(VREF+) 40(PA0-WKUP) 41(PA1) 43(PH2) 44(PH3) 45(PH4) 46(PH5) 50(PA4) 51(PA5) 52(PA6) 53(PA7) 54(PC4) 55(PC5) 59(PF11) 60(PF12) 63(PF13) 64(PF14) 65(PF15) 66(PG0) 67(PG1) 68(PE7) 69(PE8) 70(PE9) 73(PE10) 74(PE11) 75(PE12) 76(PE13) 77(PE14) 78(PE15) 83(PH6) 84(PH7) 85(PH8) 86(PH9) 87(PH10) 88(PH11) 89(PH12) 96(PD8) 97(PD9) 98(PD10) 99(PD11) 100(PD12) 101(PD13) 104(PD14) 105(PD15) 106(PG2) 107(PG3) 108(PG4) 109(PG5) 110(PG6) 111(PG7) 112(PG8) 114(VDD33USB) 115(PC6) 116(PC7) 117(PC8) 118(PC9) 119(PA8) 124(PA13) 128(PH13) 129(PH14) 130(PH15) 131(PI0) 132(PI1) 133(PI2) 134(PI3) 137(PA14) 138(PA15) 142(PD0) 143(PD1) 144(PD2) 145(PD3) 146(PD4) 147(PD5) 150(PD6) 155(PG12) 156(PG13) 157(PG14) 160(PG15) 161(PB3) 162(PB4) 163(PB5) 167(PB8) 168(PB9) 169(PE0) 170(PE1) 171(PDR_ON) 173(PI4) 174(PI5) 175(PI6) 176(PI7); U27 4(1PPS)* 5(ON/OFF)* 7(NC)* 9(NRESET)* 13(NC)* 15(Reserved)* 16(SDA)* 17(SCL)* 18(Reserved)*; USB3 A8(SBU1)* B8(SBU2)*

## Notes on the sheet
- higher freq oscillator for H7
- ExLRS nano header
- Magnetometer
- GPS
- Barometer
- HSE clock
- F405/7 Boot Selector
- IMU
- Camera
- Radio
- Power
- USB C
